# EAGLE schematic M238D (EAGLE 6.6.0)
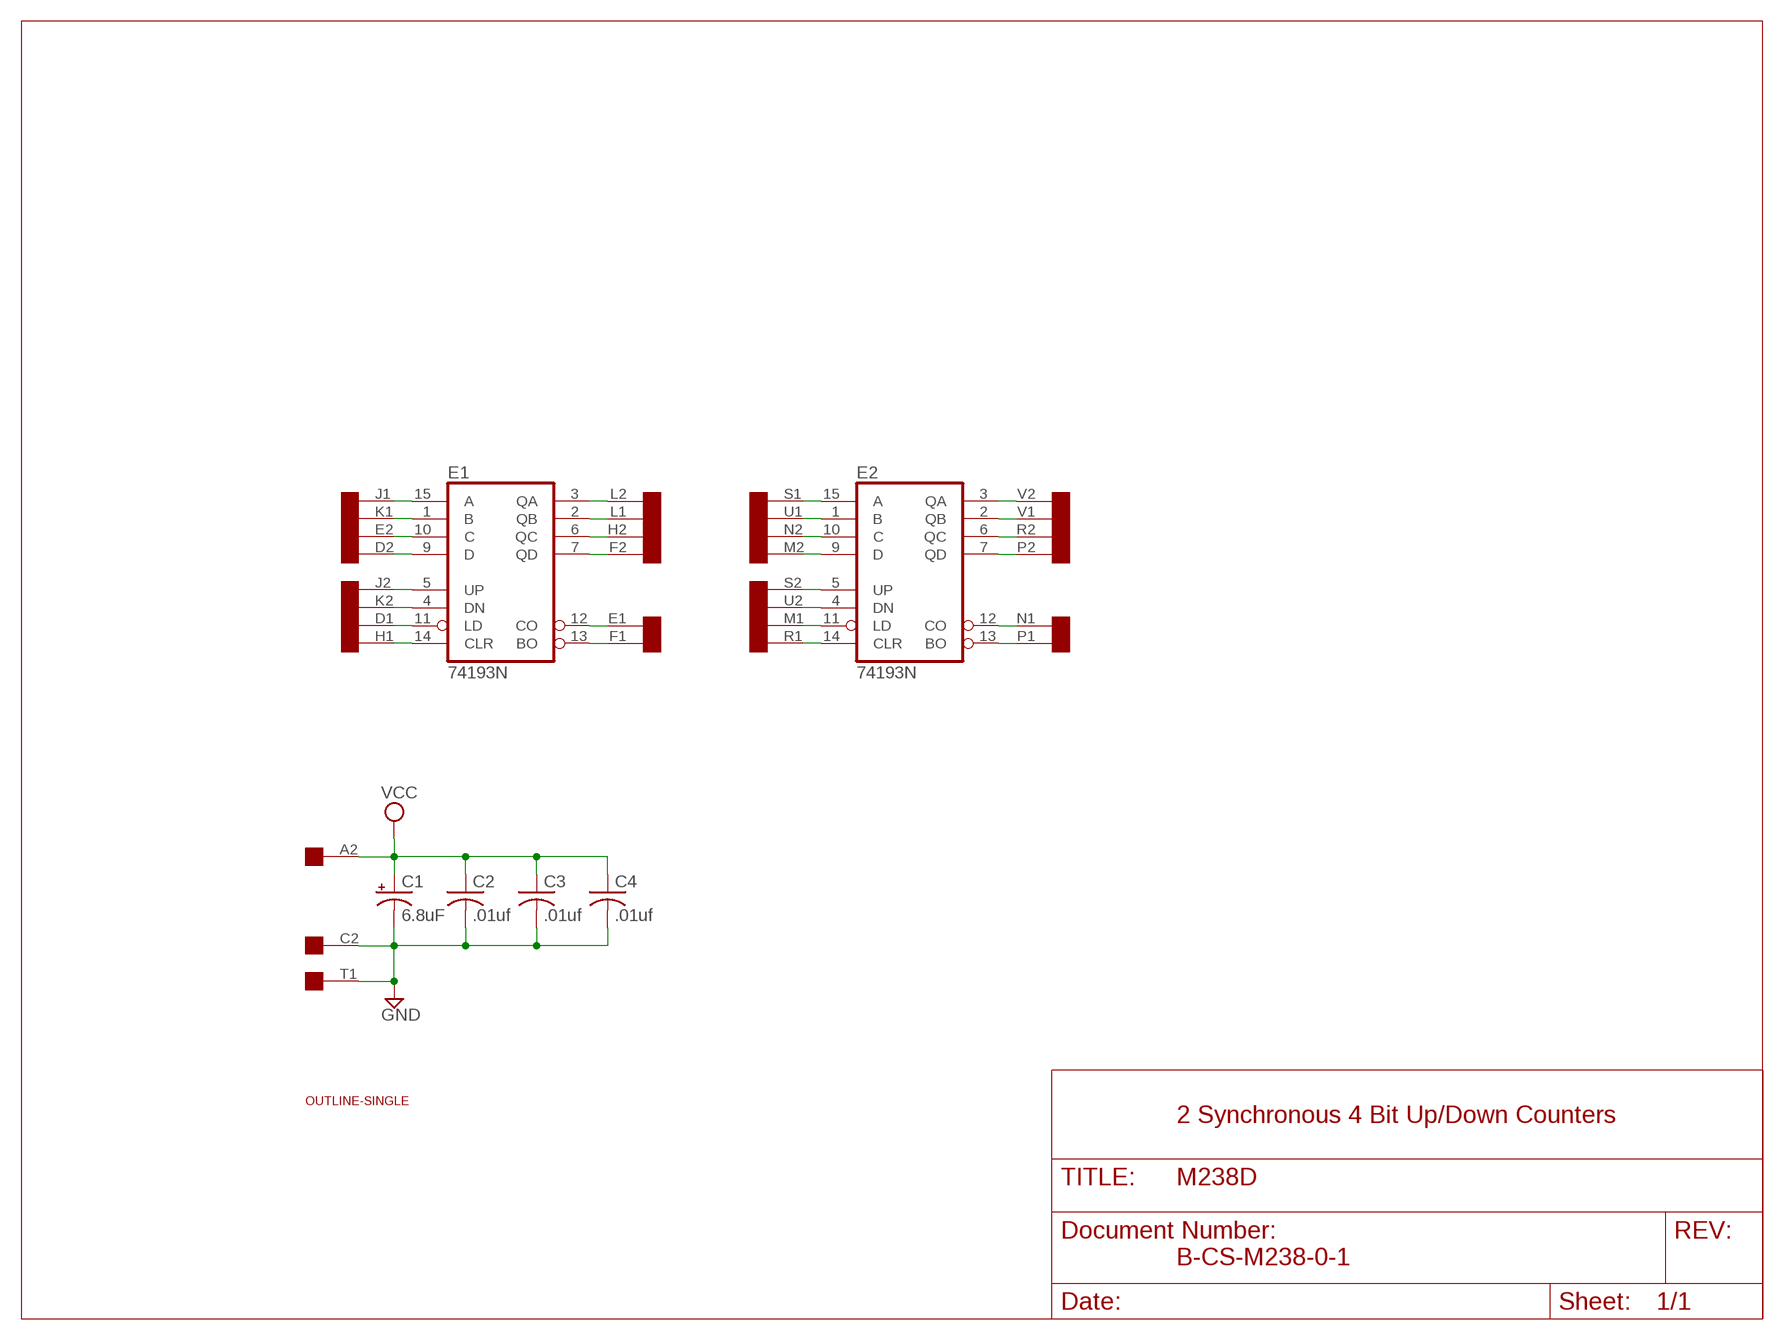
[diagram p0: schematic, sheet 1]

## Parts
C1  6.8uF  CPOL-USE20-8AXIAL  [E12-8]
C2  .01uf  C-US050-025X075  [C050-025X075]
C3  .01uf  C-US050-025X075  [C050-025X075]
C4  .01uf  C-US050-025X075  [C050-025X075]
E1  74193N  74192N  [DIL16]
E2  74193N  74192N  [DIL16]
U$1  OUTLINE-SINGLE  [SINGLE]
U$2  SINGLE  [EDGE-CON2]

## Nets
D1: E1.11(LD) U$2.D1
D2: E1.9(D) U$2.D2
E1: E1.12(CO) U$2.E1
E2: E1.10(C) U$2.E2
F1: E1.13(BO) U$2.F1
F2: E1.7(QD) U$2.F2
GND: C1.- C2.2 C3.2 C4.2 U$2.C2 U$2.T1
H1: E1.14(CLR) U$2.H1
H2: E1.6(QC) U$2.H2
J1: E1.15(A) U$2.J1
J2: E1.5(UP) U$2.J2
K1: E1.1(B) U$2.K1
K2: E1.4(DN) U$2.K2
L1: E1.2(QB) U$2.L1
L2: E1.3(QA) U$2.L2
M1: E2.11(LD) U$2.M1
M2: E2.9(D) U$2.M2
N1: E2.12(CO) U$2.N1
N2: E2.10(C) U$2.N2
P1: E2.13(BO) U$2.P1
P2: E2.7(QD) U$2.P2
R1: E2.14(CLR) U$2.R1
R2: E2.6(QC) U$2.R2
S1: E2.15(A) U$2.S1
S2: E2.5(UP) U$2.S2
U1: E2.1(B) U$2.U1
U2: E2.4(DN) U$2.U2
V1: E2.2(QB) U$2.V1
V2: E2.3(QA) U$2.V2
VCC: C1.+ C2.1 C3.1 C4.1 U$2.A2
Unconnected: U$2.A1 U$2.B1 U$2.B2 U$2.C1 U$2.T2

## Notes on the sheet
- 2 Synchronous 4 Bit Up/Down Counters
- B-CS-M238-0-1

## Power pins joined to a net without a drawn wire
GND: E1.8(GND) E2.8(GND)
VCC: E1.16(VCC) E2.16(VCC)

## Library data of the parts
C1 = dec-con:CPOL-USE20-8AXIAL: A 0.8 inch electrolytic.
C2-C4 = rcl:C-US: CAPACITOR, American symbol
E1 E2 = 74xx-us:74*192: Synchronous 4-bit UP/DOWN COUNTER
U$1 = dec-con:OUTLINE-*: Board outlines for DEC boards.
U$2 = dec-con:SINGLE: Single-Height DEC board

## Net classes
0 default: width 0.813 mm